# EAGLE design tiny45-button-2-leds-ext-pullup-power-LED (EAGLE 9.3.0)
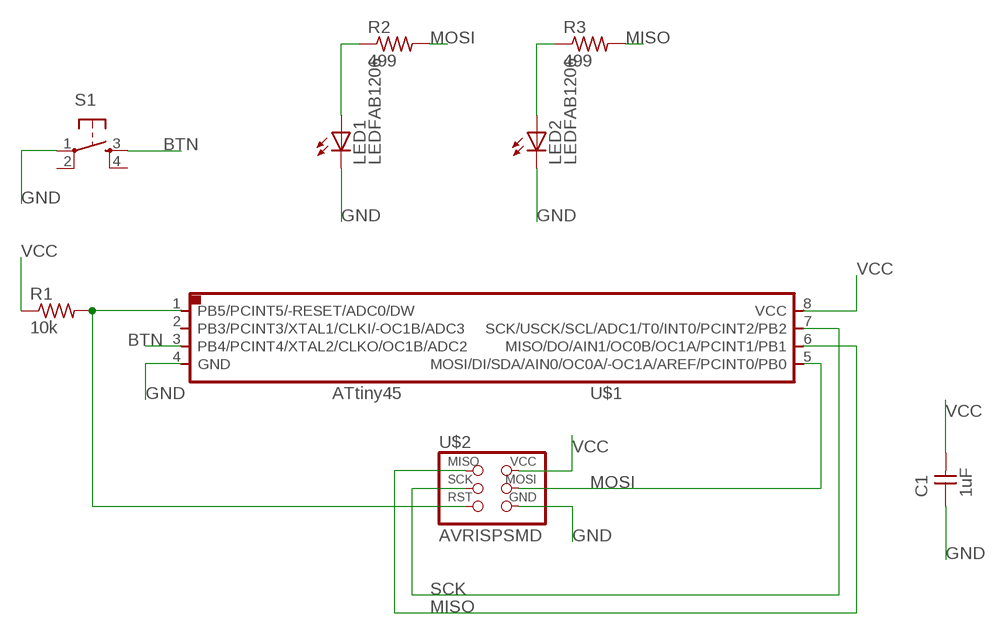
[diagram p0: schematic, sheet 1]

## Parts
C1  1uF  CAP-UNPOLARIZEDFAB  [C1206FAB]
LED1  LEDFAB1206  [LED1206FAB]
LED2  LEDFAB1206  [LED1206FAB]
R1  10k  RES-US1206FAB  [R1206FAB]
R2  499  RES-US1206FAB  [R1206FAB]
R3  499  RES-US1206FAB  [R1206FAB]
S1  6MM_SWITCH6MM_SWITCH  [6MM_SWITCH]
U$1  ATTINY45SI  [SOIC8]
U$2  AVRISPSMD  [2X03SMD]

## Nets
BTN: S1.3(S) U$1.3(PB4/PCINT4/XTAL2/CLKO/OC1B/ADC2)
GND: C1.1 LED1.2(C) LED2.2(C) S1.1(P) U$1.4(GND) U$2.6(GND)
MISO: R3.2 U$1.6(MISO/DO/AIN1/OC0B/OC1A/PCINT1/PB1) U$2.1(MISO)
MOSI: R2.2 U$1.5(MOSI/DI/SDA/AIN0/OC0A/-OC1A/AREF/PCINT0/PB0) U$2.4(MOSI)
N$1: LED2.1(A) R3.1
N$4: LED1.1(A) R2.1
N$8: R1.2 U$1.1(PB5/PCINT5/-RESET/ADC0/DW) U$2.5(RST)
SCK: U$1.7(SCK/USCK/SCL/ADC1/T0/INT0/PCINT2/PB2) U$2.3(SCK)
VCC: C1.2 R1.1 U$1.8(VCC) U$2.2(VCC)
Unconnected: S1.2(P1) S1.4(S1) U$1.2(PB3/PCINT3/XTAL1/CLKI/-OC1B/ADC3)

## Library data of the parts
C1 = fab:CAP-UNPOLARIZED
LED1 LED2 = fab:LED: LED
R1-R3 = fab:RES-US: Resistor (US Symbol) Variants with postfix FAB are widened to allow the routing of internal traces
S1 = fab:6MM_SWITCH: OMRON SWITCH
U$1 = fab:ATTINY45
U$2 = fab:AVRISP

## Board
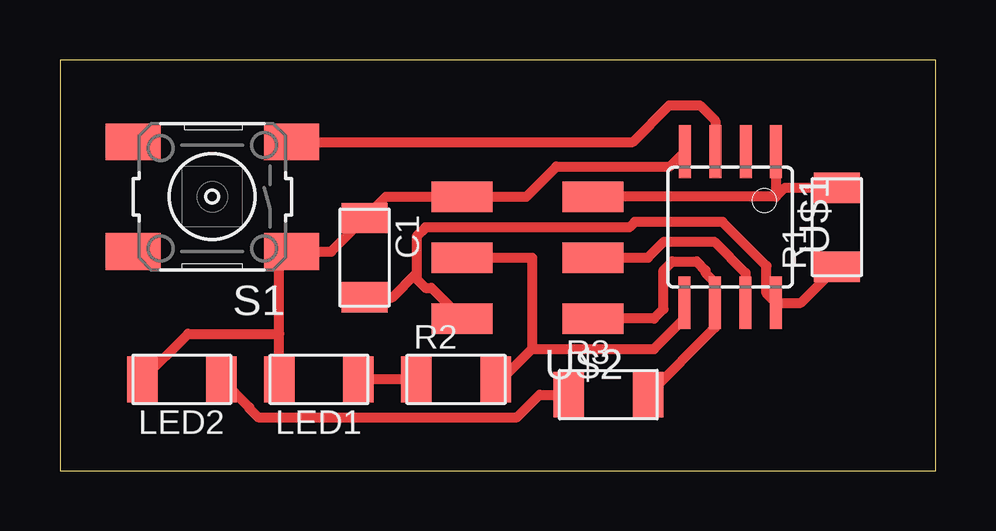
[diagram p1: board, top side]

Size 36.5 x 17.14 mm. Coordinates in mm from the lower left corner, seen from the top.
Outline: 0,0 36.5,0 36.5,17.14 0,17.14 0,0
Copper layers (1*16): Top 0.035mm / dielectric 1.5mm / Bottom 0.035mm
Design rules "fabmodule": minimum track width 10mil, minimum drill 0.4mm, track to track 0.42mm, track to pad 0.42mm, pad to pad 0.42mm, via to via 0.42mm, smd to smd 0.42mm, copper to edge 40mil, drill to drill 0.8mm, minimum pad ring 10mil, minimum via ring 8mil, stop-mask expansion 4mil, vias tented up to drill 0mil, thermal gap 10mil

### Footprints (pad centres in the part's own frame; a part is rotated, then mirrored left to right if it is on the bottom)
C1206FAB = smd 1.27 x 1.905: 1 -1.651,0; 2 1.651,0
LED1206FAB = smd 1.27 x 1.905: 1 -1.651,0; 2 1.651,0
R1206FAB = smd 1.27 x 1.905: 1 -1.651,0; 2 1.651,0
6MM_SWITCH = smd 2.286 x 1.524: 1 -3.302,2.286; 2 3.302,2.286; 3 -3.302,-2.286; 4 3.302,-2.286
SOIC8 = smd 0.5 x 2.2: 1 -1.905,-3.154; 2 -0.645,-3.154; 3 0.625,-3.154; 4 1.895,-3.154; 5 1.905,3.154; 6 0.635,3.154; 7 -0.635,3.154; 8 -1.905,3.154
2X03SMD = smd 2.54 x 1.27: 1 -2.54,2.54; 2 2.92,2.54; 3 -2.54,0; 4 2.92,0; 5 -2.54,-2.54; 6 2.92,-2.54

### Placement (x,y rotation side)
C1  12.7,8.89 270 top
LED1  10.79,3.81 180 top
LED2  5.08,3.81 180 top
R1  32.38,10.16 90 top
R2  16.51,3.81 0 top
R3  22.86,3.17 0 top
S1  6.35,11.43 180 top
U$1  27.94,10.16 180 top
U$2  19.68,8.89 180 top

### Tracks (layer width: path | path; a pad name or v marks a point on that pad's centre or on a via)
BTN
  Top 0.406: S1.3 23.88,13.72 25.4,15.24 26.67,15.24 27.32,14.6 U$1.3
GND
  Top 0.406: U$1.4 25.42,12.69 20.7,12.69 19.44,11.43 U$2.6 13.59,11.43 C1.1 11.3,9.14 S1.1 9.14,8.64 9.14,5.71 | LED1.2 9.14,5.71 | LED2.2 5.33,5.71 9.14,5.71
MISO
  Top 0.406: R3.2 27.3,5.97 U$1.6 27.3,7.86 26.91,8.26 26.91,8.36 26.54,8.73 25.53,8.73 25.16,8.36 25.16,6.75 24.77,6.35 U$2.1
MOSI
  Top 0.406: U$2.4 19.68,8.89 19.68,5.08 | 19.68,5.08 24.77,5.08 26.04,6.35 U$1.5 | 19.68,5.08 18.41,3.81 R2.2
N$1
  Top 0.406: R3.1 20,3.17 19.05,2.23 8.25,2.23 7.89,2.6 7.89,2.65 LED2.1
N$4
  Top 0.406: R2.1 LED1.1
N$8
  Top 0.406: U$1.1 29.84,11.43 | 29.84,11.43 30.23,11.81 R1.2 | 29.84,11.43 U$2.5
SCK
  Top 0.406: U$2.3 24.52,8.89 25.18,9.56 27.27,9.56 28.57,8.26 U$1.7
VCC
  Top 0.406: R1.1 30.88,7.01 U$1.8 29.45,7.4 29.45,8.55 27.62,10.38 23.96,10.38 23.73,10.15 15.24,10.15 14.87,9.78 14.87,8.26 | 14.87,8.26 14.87,8 15.24,7.63 15.48,7.63 U$2.2 | C1.2 13.86,7.24 14.87,8.26